# Altium schematic sheet MIPI CSI 0 and 1 Connectors.SchDoc: RK3399 COB Design V1.0
size A3; Author: ABC; Organization: Altium Limited; Address1: L3, 12a Rodborough Rd; Address2: Frenchs Forest; Address3: NSW; Address4: Australia 2086; DocumentNumber: 22; SheetNumber: 22; SheetTotal: 27; PROJECT CODE: A_V1.0
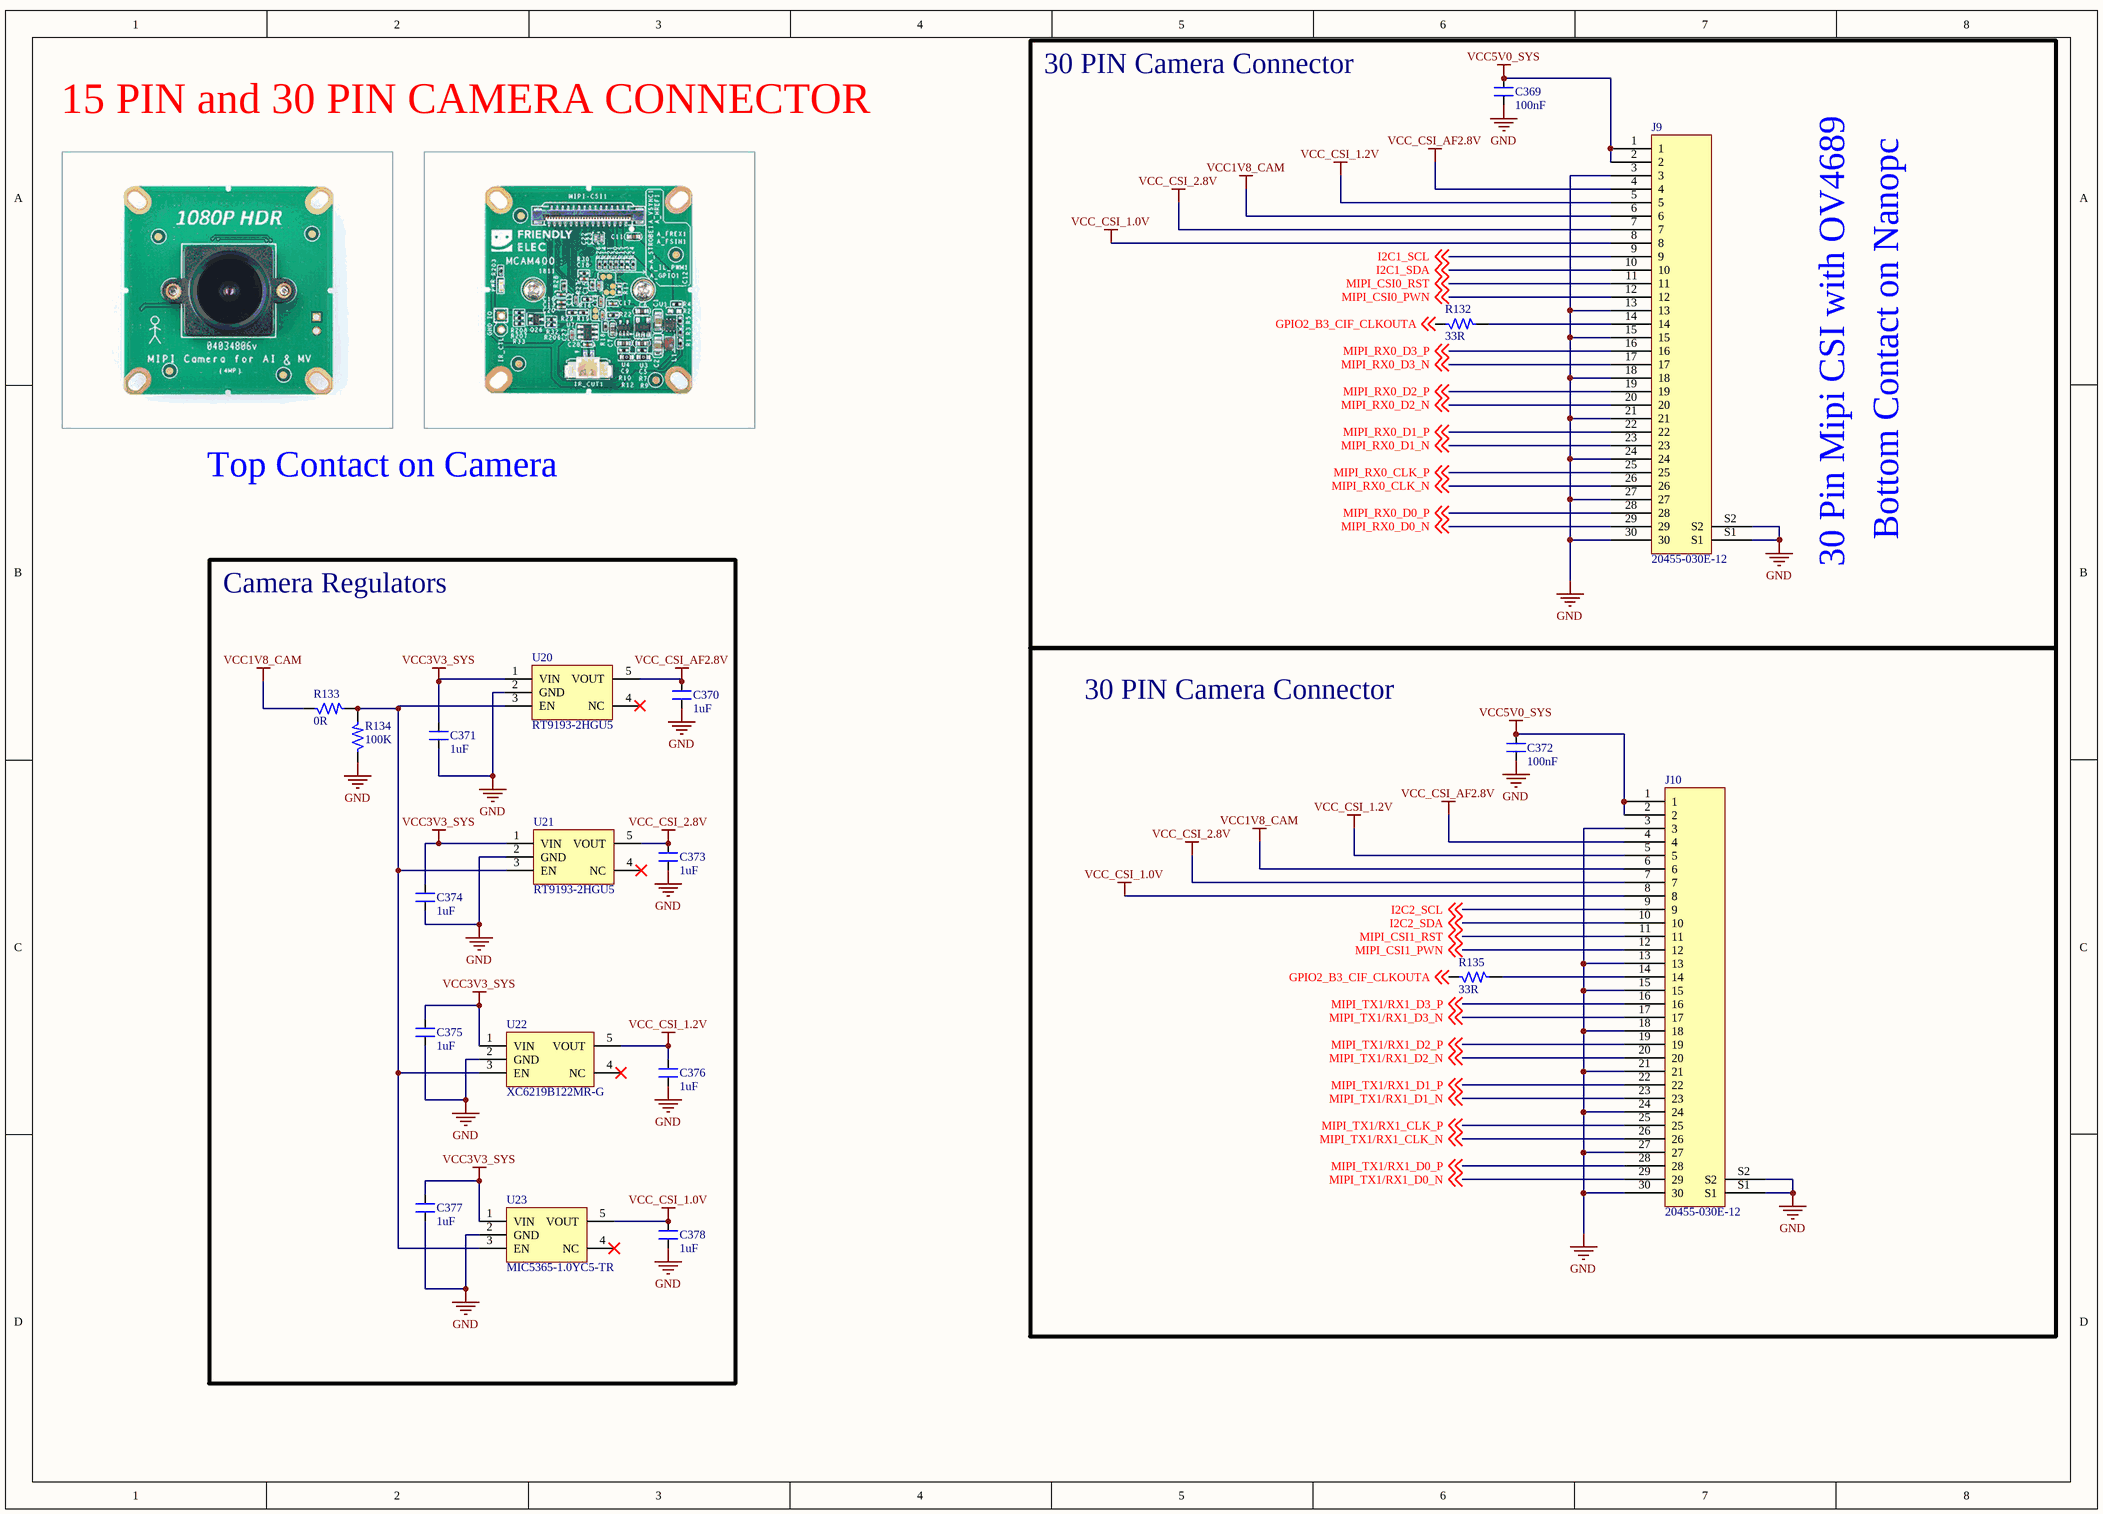
[diagram p0: MIPI CSI 0 and 1 Connectors.SchDoc]

## Parts
C369  100nF  [CAP_0603]
C370  1uF  [CAP_0603]
C371  1uF  [CAP_0603]
C372  100nF  [CAP_0603]
C373  1uF  [CAP_0603]
C374  1uF  [CAP_0603]
C375  1uF  [CAP_0603]
C376  1uF  [CAP_0603]
C377  1uF  [CAP_0603]
C378  1uF  [CAP_0603]
J9  20455-030E-12  [CON30_19_68713014522 _SMD_RA]
J10  20455-030E-12  [CON30_19_68713014522 _SMD_RA]
R132  33R  [RES_0402]
R133  0R  [RES_0603]
R134  100K  [RES_0603]
R135  33R  [RES_0402]
U20  RT9193-2HGU5  [SOT23-5]
U21  RT9193-2HGU5  [SOT23-5]
U22  XC6219B122MR-G  [SOT23-5]
U23  MIC5365-1.0YC5-TR  [SOT23-5]

## Blocks framed on the sheet
Camera Regulators: C370 C371 C373-C378 R133 R134 U20-U23
30 PIN Camera Connector: C372 J10 R135

## Nets
GND: C369.1 C370.1 C371.1 C372.1 C373.1 C374.1 C375.1 C376.1 C377.1 C378.1 J9.3 J9.13 J9.15 J9.18 J9.21 J9.24 J9.27 J9.30 J9.S1 J9.S2 J10.3 J10.13 J10.15 J10.18 J10.21 J10.24 J10.27 J10.30 J10.S1 J10.S2 R134.1 U20.2(GND) U21.2(GND) U22.2(GND) U23.2(GND)
VCC1V8_CAM: J9.6 J10.6 R133.1
VCC3V3_SYS: C371.2 C374.2 C375.2 C377.2 U20.1(VIN) U21.1(VIN) U22.1(VIN) U23.1(VIN)
VCC5V0_SYS: C369.2 C372.2 J9.1 J9.2 J10.1 J10.2
VCC_CSI_1.0V: C378.2 J9.8 J10.8 U23.5(VOUT)
VCC_CSI_1.2V: C376.2 J9.5 J10.5 U22.5(VOUT)
VCC_CSI_2.8V: C373.2 J9.7 J10.7 U21.5(VOUT)
VCC_CSI_AF2.8V: C370.2 J9.4 J10.4 U20.5(VOUT)
GPIO2_B3_CIF_CLKOUTA: R132.1 R135.1 ; off-sheet GPIO2_B3_CIF_CLKOUTA
I2C1_SCL: J9.9 ; off-sheet I2C1_SCL
I2C1_SDA: J9.10 ; off-sheet I2C1_SDA
I2C2_SCL: J10.9 ; off-sheet I2C2_SCL
I2C2_SDA: J10.10 ; off-sheet I2C2_SDA
MIPI_CSI0_PWN: J9.12 ; off-sheet MIPI_CSI0_PWN
MIPI_CSI0_RST: J9.11 ; off-sheet MIPI_CSI0_RST
MIPI_CSI1_PWN: J10.12 ; off-sheet MIPI_CSI1_PWN
MIPI_CSI1_RST: J10.11 ; off-sheet MIPI_CSI1_RST
MIPI_RX0_CLK_N: J9.26 ; off-sheet MIPI_RX0_CLK_N
MIPI_RX0_CLK_P: J9.25 ; off-sheet MIPI_RX0_CLK_P
MIPI_RX0_D0_N: J9.29 ; off-sheet MIPI_RX0_D0_N
MIPI_RX0_D0_P: J9.28 ; off-sheet MIPI_RX0_D0_P
MIPI_RX0_D1_N: J9.23 ; off-sheet MIPI_RX0_D1_N
MIPI_RX0_D1_P: J9.22 ; off-sheet MIPI_RX0_D1_P
MIPI_RX0_D2_N: J9.20 ; off-sheet MIPI_RX0_D2_N
MIPI_RX0_D2_P: J9.19 ; off-sheet MIPI_RX0_D2_P
MIPI_RX0_D3_N: J9.17 ; off-sheet MIPI_RX0_D3_N
MIPI_RX0_D3_P: J9.16 ; off-sheet MIPI_RX0_D3_P
MIPI_TX1/RX1_CLK_N: J10.26 ; off-sheet MIPI_TX1/RX1_CLK_N
MIPI_TX1/RX1_CLK_P: J10.25 ; off-sheet MIPI_TX1/RX1_CLK_P
MIPI_TX1/RX1_D0_N: J10.29 ; off-sheet MIPI_TX1/RX1_D0_N
MIPI_TX1/RX1_D0_P: J10.28 ; off-sheet MIPI_TX1/RX1_D0_P
MIPI_TX1/RX1_D1_N: J10.23 ; off-sheet MIPI_TX1/RX1_D1_N
MIPI_TX1/RX1_D1_P: J10.22 ; off-sheet MIPI_TX1/RX1_D1_P
MIPI_TX1/RX1_D2_N: J10.20 ; off-sheet MIPI_TX1/RX1_D2_N
MIPI_TX1/RX1_D2_P: J10.19 ; off-sheet MIPI_TX1/RX1_D2_P
MIPI_TX1/RX1_D3_N: J10.17 ; off-sheet MIPI_TX1/RX1_D3_N
MIPI_TX1/RX1_D3_P: J10.16 ; off-sheet MIPI_TX1/RX1_D3_P
NetJ9_14: J9.14 R132.2
NetJ10_14: J10.14 R135.2
NetR133_2: R133.2 R134.2 U20.3(EN) U21.3(EN) U22.3(EN) U23.3(EN)

Not connected (* = marked no-connect by the designer): U20 4(NC)*; U21 4(NC)*; U22 4(NC)*; U23 4(NC)*

## Notes on the sheet
- 15 PIN and 30 PIN CAMERA CONNECTOR
- 30 PIN Camera Connector
- Top Contact on Camera
- 30 Pin Mipi CSI with OV4689
- Bottom Contact on Nanopc
- TITLE:
- DOCUMENT NAME:
- SCALE 1:1
- This document is copyright of Esteempcb and shall not be revealed, produced, copied, in whole or in part, nor
- PROJECT CODE:
- TEMPLATE:
- A3
- AUTHOR:
- Sheet
- of
- used for any purpose other than submitted.

## Library data of the parts
C369 C372 = CAP_100nF-10V-5%-0603: 0.1µF ±10% 10V Ceramic Capacitor X7R 0603 (1608 Metric) /; Manufacturer: Yageo; Manufacturer Part Number: CC0603KRX7R6BB104; Case/Package: 0603; Supplier-1: Digikey
C370 C371 C373-C378 = CAP_1uF-10V-5%-0603: 1µF ±10% 10V Ceramic Capacitor X5R 0603 (1608 Metric) /; Manufacturer: Samsung Electro-Mechanics; Manufacturer Part Number: CL10A105KP8NNNC; Case/Package: 0603; Supplier-1: Digikey
J9 J10 = CON-PLG-FPC_30X1-19-RA-BC-SMD: FFC & FPC Connectors 0.5 FPC EASYON BTM CONT RA 30CKT ZIF; Manufacturer: WE; Manufacturer Part Number: 68713014522; Case/Package: SMD; Supplier-1: Mouser
R132 R135 = RES_33R-0.1W-1%-0402: 33 Ohms ±1% 0.1W, 1/10W Chip Resistor 0402 (1005 Metric) Automotive AEC-Q200 Thick Film /; Manufacturer: Panasonic Electronic Components; Manufacturer Part Number: ERJ-2RKF33R0X; Case/Package: 0402; Supplier-1: Digikey
R133 = RES_0R-0.1W-1%-0603: 0 Ohms Jumper 0.1W, 1/10W Chip Resistor 0603 (1608 Metric) Thick Film; Manufacturer: Yageo; Manufacturer Part Number: RC0603JR-070RL; Case/Package: 0603; Supplier-1: Digikey
R134 = RES_100K-0.1W-1%-0603: 100 kOhms ±1% 0.1W, 1/10W Chip Resistor 0603 (1608 Metric) Automotive AEC-Q200 Thick Film /; Manufacturer: tackpole Electronics Inc; Manufacturer Part Number: RMCF0603FT100K; Case/Package: 0603; Supplier-1: Digikey
U20 U21 = REG_2.5V-5.5V-0.3A-SC-70-5: Fixed LDO Voltage Regulator, 2.5V to 5.5V, 220mV Dropout, 2.85Vout, 300mAout, SC-70-5; Manufacturer: RICHTEK; Manufacturer Part Number: RT9193-2HGU5; Case/Package: SC-70; Supplier-1: Element 14
U22 = REG_1.2V-6V-0.15A-SOT-25-5: LDO Voltage Regulators; Manufacturer: Torex Semiconductor; Manufacturer Part Number: XC6219B122MR-G; Case/Package: SOT-25-5; Supplier-1: Mouser
U23 = REG_1V-5.5V-0.15A-SC-70-5: LDO Voltage Regulators Ultra Small Single 150mA LDO; Manufacturer: Microchip Technology / Micrel; Manuafcturer Part Number: MIC5365-1.0YC5-TR; Case/Package: SC-70-5; Supplier-1: Mouser